# EAGLE schematic RaspberryPi-breakout-Alt (EAGLE 7.5.0)
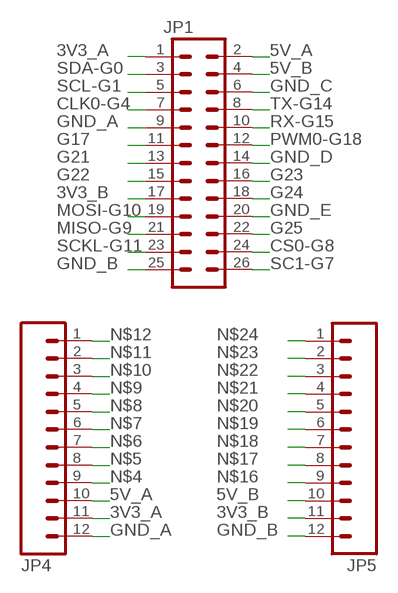
[diagram p0: schematic, sheet 1]

## Parts
JP1  M13X22X13  [2X13]
JP4  M12PTH  [1X12]
JP5  M12PTH  [1X12]

## Nets
3V3_A: JP1.1 JP4.11
3V3_B: JP1.17 JP5.11
5V_A: JP1.2 JP4.10
5V_B: JP1.4 JP5.10
CLK0-G4: JP1.7
CS0-G8: JP1.24
G17: JP1.11
G21: JP1.13
G22: JP1.15
G23: JP1.16
G24: JP1.18
G25: JP1.22
GND_A: JP1.9 JP4.12
GND_B: JP1.25 JP5.12
GND_C: JP1.6
GND_D: JP1.14
GND_E: JP1.20
MISO-G9: JP1.21
MOSI-G10: JP1.19
N$4: JP4.9
N$5: JP4.8
N$6: JP4.7
N$7: JP4.6
N$8: JP4.5
N$9: JP4.4
N$10: JP4.3
N$11: JP4.2
N$12: JP4.1
N$16: JP5.9
N$17: JP5.8
N$18: JP5.7
N$19: JP5.6
N$20: JP5.5
N$21: JP5.4
N$22: JP5.3
N$23: JP5.2
N$24: JP5.1
PWM0-G18: JP1.12
RX-G15: JP1.10
SC1-G7: JP1.26
SCKL-G11: JP1.23
SCL-G1: JP1.5
SDA-G0: JP1.3
TX-G14: JP1.8

## Library data of the parts
JP1 = SparkFun-Connectors:M13X2: 0.1" spaced headers
JP4 JP5 = SparkFun-Connectors:M12: Header 12 Standard 12-pin 0.1" header. Use with straight break away headers (SKU : PRT-00116), right angle break away headers (PRT-00553), swiss pins (PRT-00743), machine pins (PRT-00117), and female headers (PRT-00115).